# EAGLE schematic rev2 (EAGLE 7.2.0)
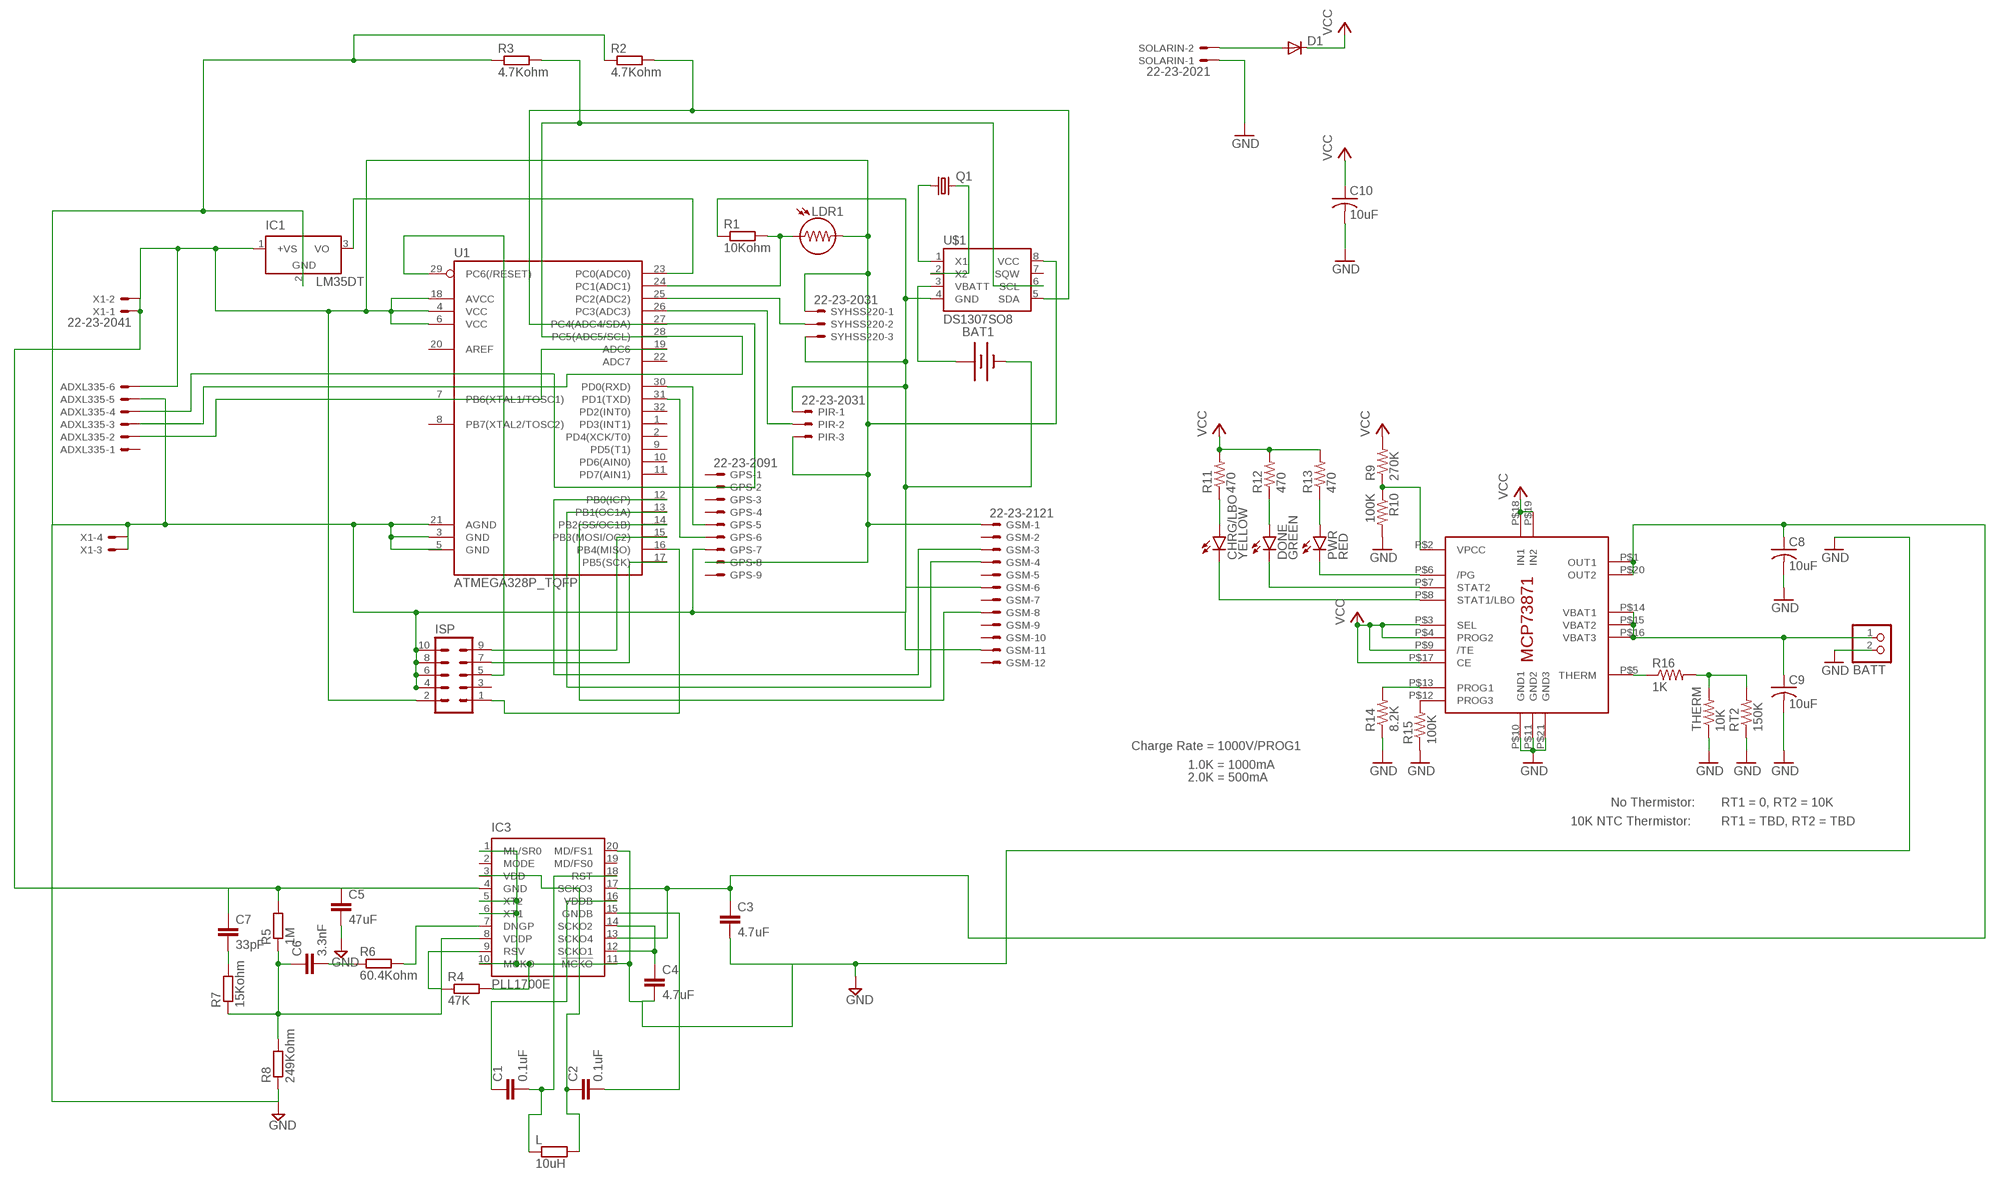
[diagram p0: schematic, sheet 1]

## Parts
ADXL335  22-23-2061  [22-23-2061]
BAT1  BATTERY20PTH  [BATTCOM_20MM_PTH]
BATT  JST_2PIN-SMT-RA  [JST-PH-2-SMT-RA]
C1  0.1uF  0.1UF-16V(+-10%)(0402)  [0402-CAP]
C2  0.1uF  0.1UF-16V(+-10%)(0402)  [0402-CAP]
C3  4.7uF  4.7UF-6.3V-10%(0603)0603  [0603-CAP]
C4  4.7uF  4.7UF-6.3V-10%(0603)0603  [0603-CAP]
C5  47uF  CAP0603-CAP  [0603-CAP]
C6  3.3nF  3.3NF-100V-10%(0603)  [0603-CAP]
C7  33pF  33PF-50V-5%-(0603)  [0603-CAP]
C8  10uF  C-USC0805K  [C0805K]
C9  10uF  C-USC0805K  [C0805K]
C10  10uF  C-USC0805K  [C0805K]
CHRG/LBO  YELLOW  LED-YELLOWLARGE  [LED-1206]
D1  DIODEPTH  [DIODE-1N4001]
DONE  GREEN  LED-GREENLARGE  [LED-1206]
GPS  22-23-2091  [22-23-2091]
GSM  22-23-2121  [22-23-2121]
IC1  LM35DT  [TO220V]
IC2  MCP73871  [QFN20_4MM]
IC3  PLL1700E  [SSOP20]
ISP  ML10  [ML10]
L  10uH  6MM-EU4  [R0207/4]
LDR1  LDR5MM  [LDR338-54C]
PIR  22-23-2031  [22-23-2031]
PWR  RED  LED-RED1206  [LED-1206]
Q1  CRYSTALTC26H  [TC26H]
R1  10Kohm  R-EU_M1206  [M1206]
R2  4.7Kohm  R-EU_M1206  [M1206]
R3  4.7Kohm  R-EU_M1206  [M1206]
R4  47K  R-EU_M3216  [M3216]
R5  1M  R-EU_M3216  [M3216]
R6  60.4Kohm  R-EU_M3216  [M3216]
R7  15Kohm  R-EU_M1206  [M1206]
R8  249Kohm  R-EU_M1206  [M1206]
R9  270K  R-US_R0805  [R0805]
R10  100K  R-US_R0805  [R0805]
R11  470  470OHM1/10W1%(0603)  [0603-RES]
R12  470  470OHM1/10W1%(0603)  [0603-RES]
R13  470  470OHM1/10W1%(0603)  [0603-RES]
R14  8.2K  8.2KOHM-1/10W-5%(0603)  [0603-RES]
R15  100K  R-US_R0805  [R0805]
R16  1K  R-US_M0805  [M0805]
RT2  150K  R-US_M0805  [M0805]
SOLARIN  22-23-2021  [22-23-2021]
SYHSS220  22-23-2031  [22-23-2031]
THERM  10K  R-US_FLIPFLOP  [0805-THM]
U1  ATMEGA328P_TQFP  [TQFP32-08]
U$1  DS1307SO8  [SO08]
X1  22-23-2041  [22-23-2041]

## Nets
BATT: BATT.1 C9.1 IC2.P$14(VBAT1) IC2.P$15(VBAT2) IC2.P$16(VBAT3)
GND: ADXL335.5 BAT1.2(-) BATT.2 C3.2 C4.2 C5.2 C8.2 C9.2 C10.2 GPS.7 GSM.6 GSM.11 IC1.2(GND) IC2.P$10(GND1) IC2.P$11(GND2) IC2.P$21(GND3) IC3.1(ML/SR0) IC3.5(XT2) IC3.6(XT1) IC3.10(MCKO) IC3.11(!MCKO) IC3.20(MD/FS1) ISP.4 ISP.6 ISP.8 ISP.10 PIR.1 R1.1 R2.1 R3.1 R4.2 R8.1 R10.2 R14.1 R15.1 RT2.1 SOLARIN.1 SYHSS220.3 THERM.1 U1.3(GND) U1.21(AGND) U$1.4(GND) X1.3 X1.4
N$3: GPS.5 U1.30(PD0(RXD))
N$4: IC1.3(VO) U1.23(PC0(ADC0))
N$5: LDR1.1 R1.2 U1.24(PC1(ADC1))
N$6: GPS.6 U1.31(PD1(TXD))
N$7: SYHSS220.2 U1.25(PC2(ADC2))
N$8: PIR.2 U1.26(PC3(ADC3))
N$9: ADXL335.2 U1.19(ADC6)
N$10: ADXL335.3 R3.2 U1.28(PC5(ADC5/SCL)) U$1.6(SCL)
N$11: GSM.3 U1.12(PB0(ICP))
N$12: Q1.1 U$1.1(X1)
N$13: Q1.2 U$1.2(X2)
N$14: GSM.4 U1.13(PB1(OC1A))
N$15: BAT1.1(+) U$1.3(VBATT)
N$16: GSM.8 U1.14(PB2(SS/OC1B))
N$17: IC2.P$2(VPCC) R9.1 R10.1
N$18: IC2.P$6(/PG) PWR.C
N$20: ISP.1 U1.16(PB4(MISO))
N$21: ISP.5 U1.29(PC6(/RESET))
N$22: ISP.7 U1.17(PB5(SCK))
N$23: ISP.9 U1.15(PB3(MOSI/OC2))
N$27: DONE.C IC2.P$7(STAT2)
N$28: CHRG/LBO.C IC2.P$8(STAT1/LBO)
N$29: C1.1 IC3.16(VDDB)
N$30: CHRG/LBO.A R11.1
N$31: DONE.A R12.1
N$32: C2.2 IC3.15(GNDB)
N$33: PWR.A R13.1
N$34: IC2.P$12(PROG3) R15.2
N$35: C1.2 IC3.18(RST) L.1
N$36: C2.1 IC3.3(VDD) L.2
N$37: ADXL335.6 C5.1 C7.1 GPS.8 GSM.1 IC1.1(+VS) IC3.4(GND) ISP.2 LDR1.2 PIR.3 R5.2 SYHSS220.1 U1.4(VCC) U1.6(VCC) U1.18(AVCC) U$1.8(VCC) X1.1 X1.2
N$38: C6.1 IC3.8(VDDP) R5.1 R7.1 R8.2
N$40: C6.2 R6.1
N$41: IC3.7(DNGP) R6.2
N$42: ADXL335.4 R2.2 U1.27(PC4(ADC4/SDA)) U$1.5(SDA)
N$43: C7.2 R7.2
N$44: C4.1 IC3.12(SCKO1) IC3.14(SCKO2)
N$45: IC3.9(RSV) R4.1
N$46: IC2.P$13(PROG1) R14.2
N$47: IC2.P$5(THERM) R16.1
N$48: R16.2 RT2.2 THERM.2
N$49: D1.A SOLARIN.2
OUT: C3.1 C8.1 IC2.P$1(OUT1) IC2.P$20(OUT2) IC3.13(SCKO4) IC3.17(SCKO3)
VCC: C10.1 D1.C IC2.P$3(SEL) IC2.P$4(PROG2) IC2.P$9(/TE) IC2.P$17(CE) IC2.P$18(IN1) IC2.P$19(IN2) R9.2 R11.2 R12.2 R13.2
Unconnected: ADXL335.1 GPS.1 GPS.2 GPS.3 GPS.4 GPS.9 GSM.2 GSM.5 GSM.7 GSM.9 GSM.10 GSM.12 IC3.2(MODE) IC3.19(MD/FS0) ISP.3 U1.1(PD3(INT1)) U1.2(PD4(XCK/T0)) U1.5(GND) U1.7(PB6(XTAL1/TOSC1)) U1.8(PB7(XTAL2/TOSC2)) U1.9(PD5(T1)) U1.10(PD6(AIN0)) U1.11(PD7(AIN1)) U1.20(AREF) U1.22(ADC7) U1.32(PD2(INT0)) U$1.7(SQW)

## Notes on the sheet
- Charge Rate = 1000V/PROG1
- 1.0K = 1000mA
- 2.0K = 500mA
- No Thermistor: | RT1 = 0, RT2 = 10K
- 10K NTC Thermistor: | RT1 = TBD, RT2 = TBD

## Library data of the parts
ADXL335 = con-molex:22-23-2061: .100" (2.54mm) Center Header - 6 Pin; MF: MOLEX; MPN: 22-23-2061; OC_FARNELL: 1462922; OC_NEWARK: 27C1933
BAT1 = SparkFun:BATTERY: Battery Holders Various common sizes : AA, AAA, 20mm coin cell and 12mm coin cell.
BATT = adafruit:JST_2PIN: JST 2-Pin Connectors of various flavors SMT-RA (S2B-PH-SM4) 4UConnector #17311 SMT (B2B-PH-SM4) THM-RA (S2B-PH) THM (B2B-PH)
C1 C2 = SparkFun-Capacitors:0.1UF-16V(+-10%)(0402); PROD_ID: CAP-12416
C3 C4 = SparkFun-Capacitors:4.7UF-6.3V-10%(0603): CAP-08280; PROD_ID: CAP-08280
C5 = SparkFun:CAP: Capacitor Standard 0603 ceramic capacitor, and 0.1" leaded capacitor.
C6 = SparkFun-Capacitors:3.3NF-100V-10%(0603): CAP-09633; PROD_ID: CAP-09633
C7 = SparkFun-Capacitors:33PF-50V-5%-(0603): CAP-10142; PROD_ID: CAP-10142
C8-C10 = adafruit:C-US: CAPACITOR, American symbol
CHRG/LBO = SparkFun-LED:LED-YELLOW: Yellow SMD LEDs LilyPad 1206- DIO-09909 0603- DIO-09003; PROD_ID: DIO-00820
D1 = SparkFun:DIODE: Diode These are standard reverse protection diodes and small signal diodes. SMA package can handle up to about 1A. SOD-323 can handle about 200mA. What the SOD-323 package when ordering, there are some mfgs out there that are 5-pin packages.
DONE = SparkFun-LED:LED-GREEN: Various green LEDs Green LEDs used in SFE Production 0603- DIO-00821 LARGE- DIO-00862 LILYPAD- DIO-09910; PROD_ID: DIO-00862
GPS = con-molex:22-23-2091: .100" (2.54mm) Center Header - 9 Pin; MF: MOLEX; MPN: 22-23-2091; OC_FARNELL: 1756827; OC_NEWARK: 56H0450
GSM = con-molex:22-23-2121: .100" (2.54mm) Center Header - 12 Pin; MF: MOLEX; MPN: 22-23-2121; OC_FARNELL: 1462935; OC_NEWARK: 56H0456
IC1 = lm35:LM35: Single-Supply Centigrade Temperature Sensor Vout = (10mV/°C x Temp °C) +5mmmV Source: http://www.national.com/ds/LM/LM35.pdf
IC2 = adafruit:MCP73871
IC3 = texas:PLL1700*: MULTI-CLOCK GENERATOR GENERATED AUDIO SYSTEM CLOCK Phase Lock Loop (PLL).; MF: TEXAS INSTRUMENT CONNECTORS; MPN: PLL1700E; OC_FARNELL: unknown; OC_NEWARK: 36K3452
ISP = con-harting-ml:ML10: HARTING; OC_FARNELL: unknown; OC_NEWARK: unknown
L = gm-resistors:6MM-EU: 6mm Resistors (European schematic symbol) Leads spaced 1-6 holes apart for 0.1" perfboard. Suitable for 1/4 watt resistors.
LDR1 = gm-resistors:LDR
PIR SYHSS220 = con-molex:22-23-2031: .100" (2.54mm) Center Header - 3 Pin; MF: MOLEX; MPN: 22-23-2031; OC_FARNELL: 1462950; OC_NEWARK: 30C0862
PWR = SparkFun-LED:LED-RED: Assorted Red LEDs LilyPad 1206- DIO-09912 1206- DIO-00809 0603- DIO-00819; PROD_ID: DIO-00809
Q1 = crystal:CRYSTAL: CRYSTAL; OC_FARNELL: unknown; OC_NEWARK: unknown
R1-R8 = resistor:R-EU_: RESISTOR, European symbol
R9 R10 R15 R16 RT2 THERM = adafruit:R-US_: RESISTOR, American symbol
R11-R13 = SparkFun-Resistors:470OHM1/10W1%(0603): RES-07869; PROD_ID: RES-07869
R14 = SparkFun-Resistors:8.2KOHM-1/10W-5%(0603): RES-10646; PROD_ID: RES-10646
SOLARIN = con-molex:22-23-2021: .100" (2.54mm) Center Header - 2 Pin; MF: MOLEX; MPN: 22-23-2021; OC_FARNELL: 1462926; OC_NEWARK: 25C3832
U1 = SparkFun-DigitalIC:ATMEGA328P_TQFP; PROD_ID: IC-09069
U$1 = SparkFun:DS1307
X1 = con-molex:22-23-2041: .100" (2.54mm) Center Header - 4 Pin; MF: MOLEX; MPN: 22-23-2041; OC_FARNELL: 1462920; OC_NEWARK: 38C0355